# EAGLE schematic project X (EAGLE 9.6.2)
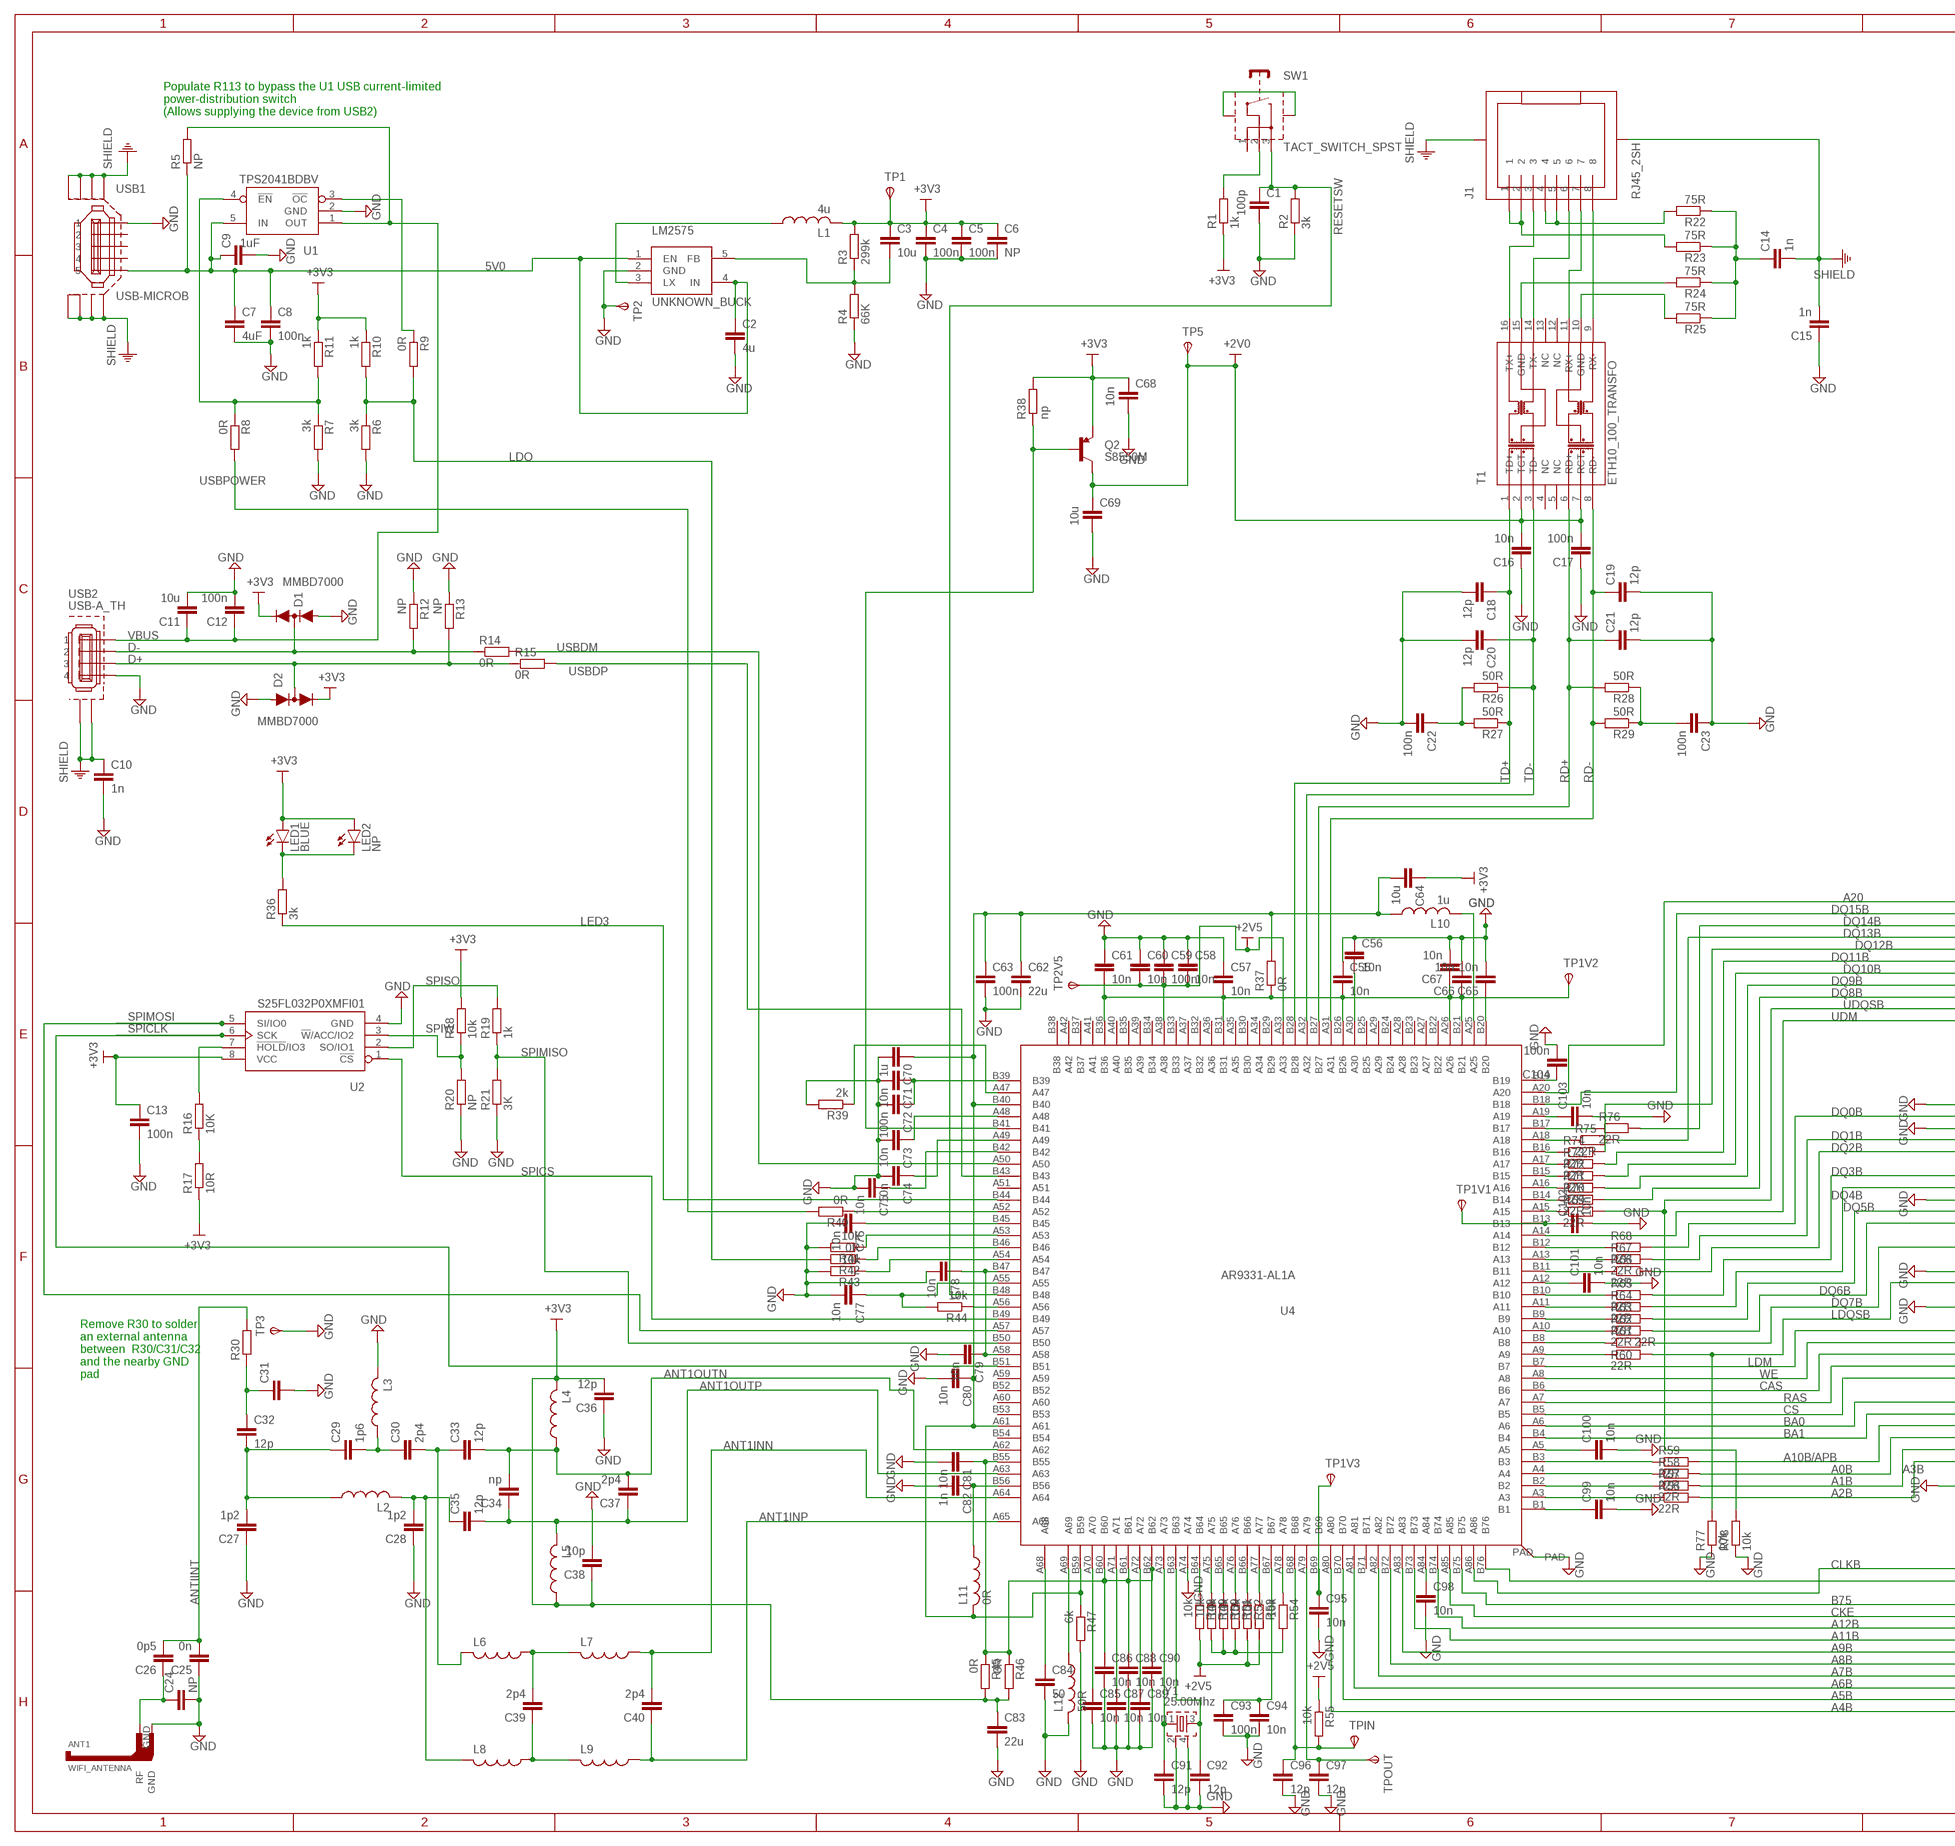
[diagram p0: schematic, sheet 1, part 1 of 2]
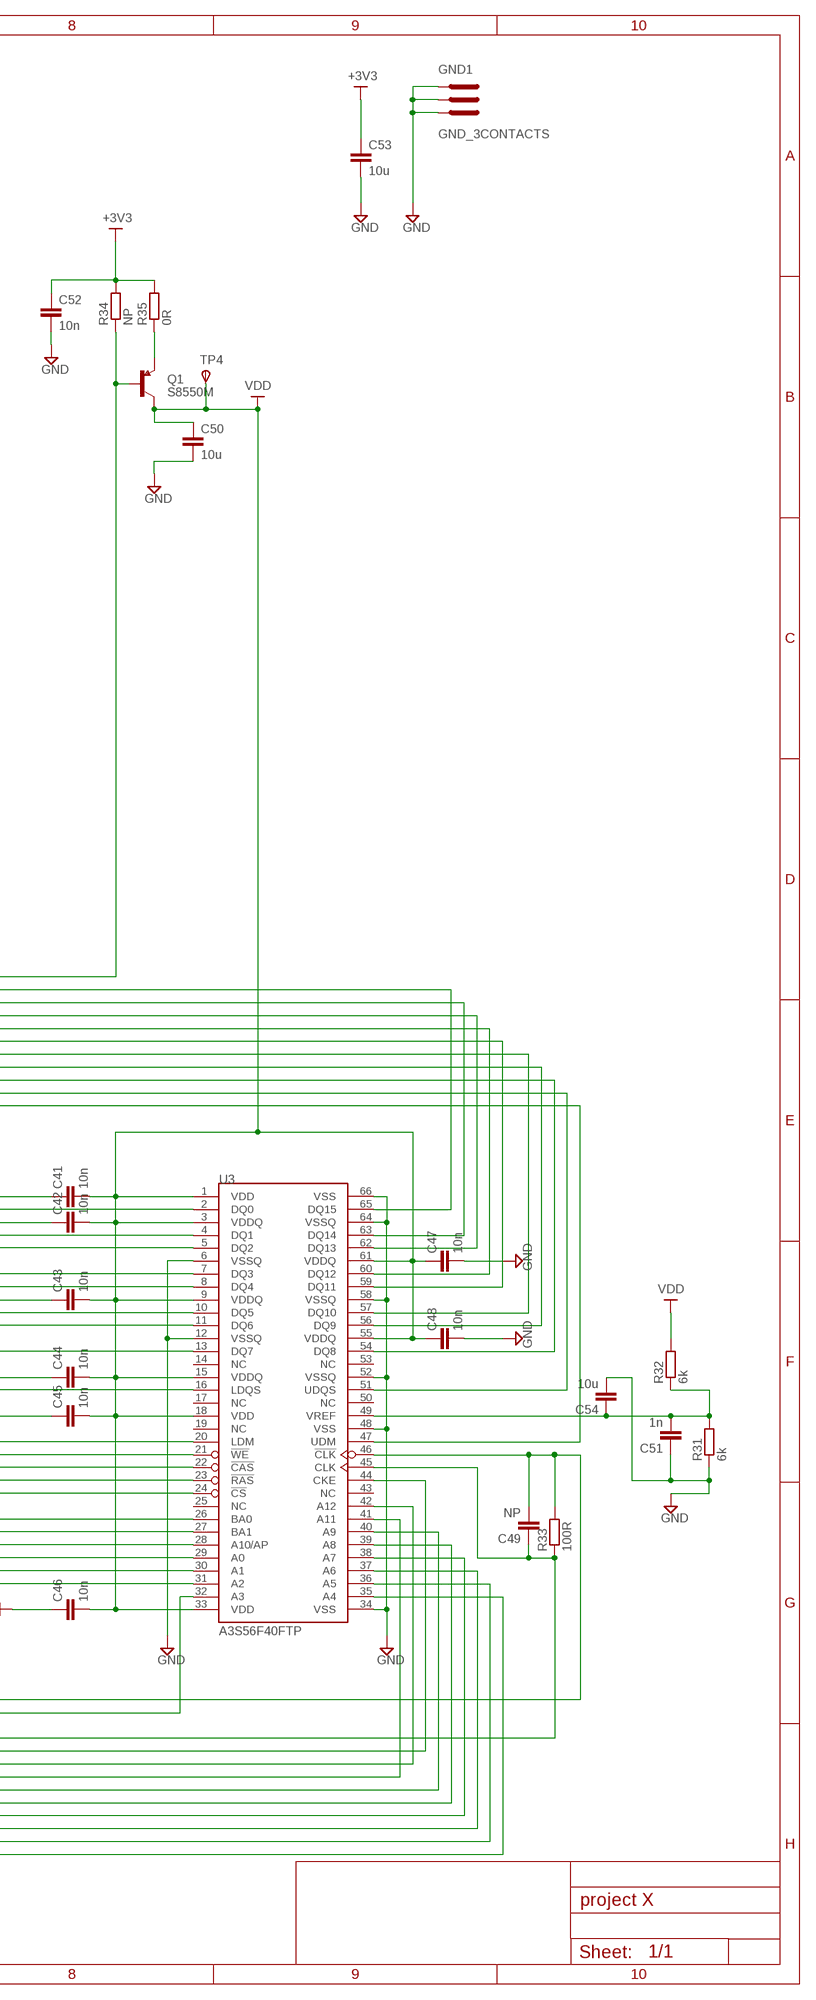
[diagram p1: schematic, sheet 1, part 2 of 2]

## Parts
ANT1  WIFI_ANTENNA  [WIFI_ANTENNA]
C1  100p  CAP_0402  [C0402]
C2  4u  CAP_0603  [C0603]
C3  10u  CAP_0603  [C0603]
C4  100n  CAP_0603  [C0603]
C5  100n  CAP_0603  [C0603]
C6  NP  CAP_0603  [C0603]
C7  4uF  CAP_0603  [C0603]
C8  100n  CAP_0603  [C0603]
C9  1uF  CAP_0603  [C0603]
C10  1n  CAP_0603  [C0603]
C11  10u  CAP_0805  [C0805]
C12  100n  CAP_0805  [C0805]
C13  100n  CAP_0603  [C0603]
C14  1n  CAP_1206  [C1206]
C15  1n  CAP_1206  [C1206]
C16  10n  CAP_1206  [C1206]
C17  100n  CAP_1206  [C1206]
C18  12p  CAP_1206  [C1206]
C19  12p  CAP_1206  [C1206]
C20  12p  CAP_1206  [C1206]
C21  12p  CAP_1206  [C1206]
C22  100n  CAP_1206  [C1206]
C23  100n  CAP_1206  [C1206]
C24  NP  CAP_0603  [C0603]
C25  0n  CAP_0603  [C0603]
C26  0p5  CAP_0603  [C0603]
C27  1p2  CAP_0603  [C0603]
C28  1p2  CAP_0603  [C0603]
C29  1p6  CAP_0603  [C0603]
C30  2p4  CAP_0603  [C0603]
C31  CAP_0603  [C0603]
C32  12p  CAP_0603  [C0603]
C33  12p  CAP_0603  [C0603]
C34  np  CAP_0603  [C0603]
C35  12p  CAP_0603  [C0603]
C36  12p  CAP_0603  [C0603]
C37  2p4  CAP_0603  [C0603]
C38  10p  CAP_0603  [C0603]
C39  2p4  CAP_0603  [C0603]
C40  2p4  CAP_0603  [C0603]
C41  10n  CAP_0603  [C0603]
C42  10n  CAP_0603  [C0603]
C43  10n  CAP_0603  [C0603]
C44  10n  CAP_0603  [C0603]
C45  10n  CAP_0603  [C0603]
C46  10n  CAP_0603  [C0603]
C47  10n  CAP_0603  [C0603]
C48  10n  CAP_0603  [C0603]
C49  NP  CAP_0603  [C0603]
C50  10u  CAP_0805  [C0805]
C51  1n  CAP_0603  [C0603]
C52  10n  CAP_0603  [C0603]
C53  10u  CAP_0805  [C0805]
C54  10u  CAP_0805  [C0805]
C55  10n  CAP_0805  [C0805]
C56  10n  CAP_0805  [C0805]
C57  10n  CAP_0805  [C0805]
C58  10n  CAP_0805  [C0805]
C59  100n  CAP_0805  [C0805]
C60  10n  CAP_0805  [C0805]
C61  10n  CAP_0805  [C0805]
C62  22u  CAP_0805  [C0805]
C63  100n  CAP_0805  [C0805]
C64  10u  CAP_0805  [C0805]
C65  10n  CAP_0805  [C0805]
C66  10n  CAP_0805  [C0805]
C67  10n  CAP_0805  [C0805]
C68  10n  CAP_0402  [C0402]
C69  10u  CAP_0402  [C0402]
C70  1u  CAP_0603  [C0603]
C71  10n  CAP_0603  [C0603]
C72  100n  CAP_0603  [C0603]
C73  10n  CAP_0603  [C0603]
C74  10n  CAP_0603  [C0603]
C75  10n  CAP_0603  [C0603]
C76  10n  CAP_0603  [C0603]
C77  10n  CAP_0603  [C0603]
C78  10n  CAP_0603  [C0603]
C79  10n  CAP_0603  [C0603]
C80  10n  CAP_0603  [C0603]
C81  10n  CAP_0603  [C0603]
C82  1n  CAP_0603  [C0603]
C83  22u  CAP_0603  [C0603]
C84  50  CAP_0603  [C0603]
C85  10n  CAP_0603  [C0603]
C86  10n  CAP_0603  [C0603]
C87  10n  CAP_0603  [C0603]
C88  10n  CAP_0603  [C0603]
C89  10n  CAP_0603  [C0603]
C90  10n  CAP_0603  [C0603]
C91  12p  CAP_0603  [C0603]
C92  12p  CAP_0603  [C0603]
C93  100n  CAP_0603  [C0603]
C94  10n  CAP_0603  [C0603]
C95  10n  CAP_0603  [C0603]
C96  12p  CAP_0603  [C0603]
C97  12p  CAP_0603  [C0603]
C98  10n  CAP_0603  [C0603]
C99  10n  CAP_0603  [C0603]
C100  10n  CAP_0603  [C0603]
C101  10n  CAP_0603  [C0603]
C102  10n  CAP_0603  [C0603]
C103  10n  CAP_0603  [C0603]
C104  100n  CAP_0603  [C0603]
D1  MMBD7000  [SOT23-3]
D2  MMBD7000  [SOT23-3]
GND1  GND_3CONTACTS  [GND_3CONTACT]
J1  RJ45_2SH  [RJ45_LP_RA_SMT]
L1  4u  IND_0402  [L0402]
L2  IND_0402  [L0402]
L3  IND_0402  [L0402]
L4  IND_0402  [L0402]
L5  IND_0402  [L0402]
L6  IND_0402  [L0402]
L7  IND_0402  [L0402]
L8  IND_0402  [L0402]
L9  IND_0402  [L0402]
L10  1u  IND_1008  [L1008]
L11  0R  IND_0402  [L0402]
L12  50R  IND_0402  [L0402]
LED1  BLUE  LED_3MM  [LED3MM]
LED2  NP  LED_3MM  [LED3MM]
LM2575  UNKNOWN_BUCK  [SOT23-5]
Q1  S8550M  TRANSISTOR_PNP  [SOT23-3]
Q2  S8550M  TRANSISTOR_PNP  [SOT23-3]
R1  1k  RES_0402  [R0402]
R2  3k  RES_0402  [R0402]
R3  299k  RES_0603  [R0603]
R4  66K  RES_0603  [R0603]
R5  NP  RES_0603  [R0603]
R6  3k  RES_0603  [R0603]
R7  3k  RES_0603  [R0603]
R8  0R  RES_0603  [R0603]
R9  0R  RES_0603  [R0603]
R10  1k  RES_0603  [R0603]
R11  1k  RES_0603  [R0603]
R12  NP  RES_0603  [R0603]
R13  NP  RES_0603  [R0603]
R14  0R  RES_0603  [R0603]
R15  0R  RES_0603  [R0603]
R16  10K  RES_0603  [R0603]
R17  10R  RES_0603  [R0603]
R18  10k  RES_0603  [R0603]
R19  1k  RES_0603  [R0603]
R20  NP  RES_0603  [R0603]
R21  3K  RES_0603  [R0603]
R22  75R  RES_0402  [R0402]
R23  75R  RES_0402  [R0402]
R24  75R  RES_0402  [R0402]
R25  75R  RES_0402  [R0402]
R26  50R  RES_0402  [R0402]
R27  50R  RES_0402  [R0402]
R28  50R  RES_0402  [R0402]
R29  50R  RES_0402  [R0402]
R30  RES_0603  [R0603]
R31  6k  RES_0603  [R0603]
R32  6k  RES_0603  [R0603]
R33  100R  RES_0603  [R0603]
R34  NP  RES_0603  [R0603]
R35  0R  RES_0603  [R0603]
R36  3k  RES_0603  [R0603]
R37  0R  RES_0603  [R0603]
R38  np  RES_0603  [R0603]
R39  2k  RES_0603  [R0603]
R40  0R  RES_0603  [R0603]
R41  10k  RES_0603  [R0603]
R42  0R  RES_0603  [R0603]
R43  10k  RES_0603  [R0603]
R44  10k  RES_0603  [R0603]
R45  0R  RES_0603  [R0603]
R46  0R  RES_0603  [R0603]
R47  6k  RES_0603  [R0603]
R48  10k  RES_0603  [R0603]
R49  10k  RES_0603  [R0603]
R50  10k  RES_0603  [R0603]
R51  10k  RES_0603  [R0603]
R52  10k  RES_0603  [R0603]
R53  10k  RES_0603  [R0603]
R54  10k  RES_0603  [R0603]
R55  10k  RES_0603  [R0603]
R56  22R  RES_0603  [R0603]
R57  22R  RES_0603  [R0603]
R58  22R  RES_0603  [R0603]
R59  22R  RES_0603  [R0603]
R60  22R  RES_0603  [R0603]
R61  22R  RES_0603  [R0603]
R62  22R  RES_0603  [R0603]
R63  22R  RES_0603  [R0603]
R64  22R  RES_0603  [R0603]
R65  22R  RES_0603  [R0603]
R66  22R  RES_0603  [R0603]
R67  22R  RES_0603  [R0603]
R68  22R  RES_0603  [R0603]
R69  22R  RES_0603  [R0603]
R70  22R  RES_0603  [R0603]
R71  22R  RES_0603  [R0603]
R72  22R  RES_0603  [R0603]
R73  22R  RES_0603  [R0603]
R74  22R  RES_0603  [R0603]
R75  22R  RES_0603  [R0603]
R76  22R  RES_0603  [R0603]
R77  10k  RES_0603  [R0603]
R78  10k  RES_0603  [R0603]
SW1  TACT_SWITCH_SPST  [TACT_SWITCH_SPST_RA_SMT]
T1  ETH10_100_TRANSFO  [H1601CG]
TP1  TEST_PAD  [TEST_PAD]
TP1V1  TEST_PAD  [TEST_PAD]
TP1V2  TEST_PAD  [TEST_PAD]
TP1V3  TEST_PAD  [TEST_PAD]
TP2  TEST_PAD  [TEST_PAD]
TP2V5  TEST_PAD  [TEST_PAD]
TP3  TEST_PAD  [TEST_PAD]
TP4  TEST_PAD  [TEST_PAD]
TP5  TEST_PAD  [TEST_PAD]
TPIN  TEST_PAD  [TEST_PAD]
TPOUT  TEST_PAD  [TEST_PAD]
U1  TPS2041BDBV  [SOT23-5]
U2  S25FL032P0XMFI01  [SOP8]
U3  A3S56F40FTP  [TSOP66]
U4  AR9331-AL1A  [DRMLF164]
USB1  USB-MICROB  [USB-MICROB]
USB2  USB-A_TH  [USB-A_TH]
Y1  25.00Mhz  CRYSTAL_2SHIELD  [CRYSTAL_32_25]

## Nets
5V0 [power]: C2.1 C7.1 C8.1 C9.1 LM2575.1(EN) LM2575.4(IN) R5.1 U1.5(IN) USB1.VBUS
+2V0 [power]: C16.2 C17.2 C69.1 Q2.3(C) T1.2(TCT) T1.7(RCT) TP5.1(PP)
+2V5 [power]: C58.2 C59.2 C60.2 R48.2 R52.2 R53.2 R55.1 TP2V5.1(PP) U4.A33 U4.A38
+3V3 [power]: C3.1 C4.1 C5.1 C6.1 C13.1 C36.2 C38.1 C52.1 C53.1 C64.1 C68.1 C83.1 D1.2(C) D2.2(C) L1.2 L4.2 L5.1 LED1.A LED2.A Q2.2(E) R1.1 R3.2 R10.1 R11.1 R17.1 R18.2 R34.2 R35.2 R38.2 R45.2 R46.2 TP1.1(PP) U2.8(VCC)
A0B: R58.2 U3.29(A0)
A1B: R57.2 U3.30(A1)
A2B: R56.2 U3.31(A2)
A3B: U3.32(A3) U4.B76
A4B: U3.35(A4) U4.A80
A5B: U3.36(A5) U4.B70
A6B: U3.37(A6) U4.A81
A7B: U3.38(A7) U4.A82
A8B: U3.39(A8) U4.B72
A9B: U3.40(A9) U4.A83
A10B/APB: R59.2 U3.28(A10/AP)
A11B: U3.41(A11) U4.B73
A12B: U3.42(A12) U4.B74
A20: Q1.1(B) R34.1 U4.A20
ANT1INN: C40.2 L7.1 U4.A64
ANT1INP [rf]: C40.1 L9.1 U4.A65
ANT1OUTN: C33.2 C34.2 C37.2 L4.1 U4.A62
ANT1OUTP: C34.1 C35.2 C37.1 L5.2 U4.A63
ANTIINT [rf]: C25.2 C26.2 R30.2
B75: C49.1 R33.1 U3.45(CLK) U4.B75
BA0: U3.26(BA0) U4.A6
BA1: U3.27(BA1) U4.B4
CAS: U3.22(!CAS) U4.B6
CKE: U3.44(CKE) U4.A85
CLKB: C49.2 R33.2 U3.46(!CLK) U4.A86
CS: U3.24(!CS) U4.B5
D+: D2.3(M) R13.2 R15.1 USB2.3
D-: D1.3(M) R12.2 R14.1 USB2.2
DQ0B: R68.2 U3.2(DQ0)
DQ1B: R67.2 U3.4(DQ1)
DQ2B: R66.2 U3.5(DQ2)
DQ3B: R65.2 U3.7(DQ3)
DQ4B: R64.2 U3.8(DQ4)
DQ5B: R63.2 U3.10(DQ5)
DQ6B: R62.2 U3.11(DQ6)
DQ7B: R61.2 U3.13(DQ7)
DQ8B: R70.2 U3.54(DQ8)
DQ9B: R71.2 U3.56(DQ9)
DQ10B: R72.2 U3.57(DQ10)
DQ11B: R73.2 U3.59(DQ11)
DQ12B: R74.2 U3.60(DQ12)
DQ13B: R75.2 U3.62(DQ13)
DQ14B: R76.2 U3.63(DQ14)
DQ15B: U3.65(DQ15) U4.B18
GND [power]: ANT1.GND C1.2 C2.2 C4.2 C5.2 C6.2 C7.2 C8.2 C9.2 C10.2 C11.2 C12.2 C13.2 C15.1 C16.1 C17.1 C18.2 C19.2 C20.2 C21.2 C22.2 C23.1 C24.2 C25.1 C27.1 C28.1 C31.2 C36.1 C38.2 C41.1 C42.1 C43.1 C44.1 C45.1 C46.1 C47.2 C48.2 C50.2 C51.1 C52.2 C53.2 C54.2 C55.1 C56.1 C57.1 C58.1 C59.1 C60.1 C61.1 C62.2 C63.2 C65.2 C66.2 C67.2 C68.2 C69.2 C70.2 C71.2 C72.2 C73.2 C74.2 C75.2 C76.2 C77.2 C78.2 C79.2 C80.2 C81.2 C82.2 C83.2 C84.2 C85.2 C86.2 C87.2 C88.2 C89.2 C90.2 C91.2 C92.2 C93.2 C94.2 C95.2 C96.2 C97.2 C98.2 C99.2 C100.2 C101.2 C102.2 C103.2 C104.2 D1.1(A) D2.1(A) GND1.GND$1(GND) GND1.GND$2(GND) GND1.GND$3(GND) L3.2 L12.2 LM2575.2(GND) R2.1 R4.1 R6.2 R7.2 R12.1 R13.1 R20.1 R21.1 R31.1 R39.2 R41.2 R43.2 R47.2 R77.1 R78.1 TP2.1(PP) TP3.1(PP) U1.2(GND) U2.4(GND) U3.6(VSSQ) U3.12(VSSQ) U3.34(VSS) U3.48(VSS) U3.52(VSSQ) U3.58(VSSQ) U3.64(VSSQ) U3.66(VSS) U4.A74 U4.PAD USB1.GND USB2.4 Y1.2 Y1.4
LDM: U3.20(LDM) U4.B7
LDO: R6.1 R9.2 R10.2 R42.2
LDQSB: R60.2 R77.2 U3.16(LDQS)
LED3: R36.1 U4.B44
N$1: C14.1 R22.1 R23.1 R24.1 R25.1
N$2: R1.2 SW1.2
N$3: SW1.S$1(SH$1) SW1.S$2(SH$2)
N$4: C3.2 LM2575.5(FB) R3.1 R4.2
N$5: C71.1 C72.1 U4.B39
N$6: Q2.1(B) R38.1 U4.B41
N$7: L1.1 LM2575.3(LX)
N$8: R7.1 R8.1 R11.2 U1.4(!EN)
N$9: C76.1 U4.B45
N$10: R40.1 U4.A52
N$11: R9.1 U1.3(!OC)
N$12: R16.1 R17.2
N$13: R16.2 U2.7(!HOLD!/IO3)
N$14: J1.1 J1.2 R23.2
N$15: J1.4 J1.5 R22.2
N$16: J1.3 T1.16(TX+)
N$17: J1.6 T1.14(TX-)
N$18: R24.2 T1.15(GND)
N$19: J1.7 T1.11(RX+)
N$20: J1.8 T1.9(RX-)
N$21: R25.2 T1.10(GND)
N$22: R41.1 U4.A53
N$23: R42.1 U4.B46
N$24: C27.2 C29.1 C32.2 L2.1
N$25: ANT1.RF C24.1 C26.1
N$26: C31.1 C32.1 R30.1
N$27: C29.2 C30.1 L3.1
N$28: C28.2 C35.1 L2.2 L8.2
N$29: C22.1 R26.2 R27.2
N$30: C30.2 C33.1 L6.2
N$31: C23.2 R28.1 R29.1
N$32: C51.2 C54.1 R31.2 R32.1 U3.49(VREF)
N$33: Q1.2(E) R35.1
N$34: C65.1 U4.B20
N$35: C39.2 L6.1 L7.2
N$36: C39.1 L8.1 L9.2
N$37: R39.1 U4.A47
N$38: LED1.K(C) LED2.K(C) R36.2
N$39: C73.1 U4.A48
N$40: C74.1 U4.A49
N$41: C75.1 U4.B42
N$42: C81.1 C86.1 C88.1 C90.1 R45.1 R46.1 U4.B55 U4.B60 U4.B61 U4.B62
N$43: C56.2 U4.A30
N$44: C55.2 C57.2 C61.2 C66.1 C67.1 R37.1 TP1V2.1(PP) U4.A26 U4.B21 U4.B26 U4.B31 U4.B36
N$45: C62.1 C63.1 C64.2 C70.1 C80.1 L10.1 L11.2 R37.2 R47.1 U4.A61 U4.B40 U4.B59
N$46: R43.1 U4.A54
N$47: C95.1 TP1V3.1(PP) U4.B69
N$48: C78.1 C79.1 U4.A58 U4.B47
N$49: C82.1 L11.1 U4.B56
N$50: C77.1 R44.2 U4.A55
N$51: R44.1 U4.A56
N$52: C91.1 U4.A73 Y1.1
N$53: C84.1 U4.A68
N$54: C92.1 U4.B63 Y1.3
N$55: L12.1 U4.A69
N$56: R49.2 R50.2 R51.2 R54.2
N$57: C85.1 U4.A70
N$58: R48.1 U4.B64
N$59: C87.1 U4.A71
N$60: R49.1 U4.A75
N$61: C89.1 U4.A72
N$62: R50.1 U4.B65
N$63: R51.1 U4.A76
N$64: R52.1 U4.B66
N$65: R53.1 U4.A77
N$66: R54.1 U4.A78
N$67: C93.1 C94.1 U4.B67
N$68: L10.2 U4.A25
N$69: C96.1 R55.2 TPIN.1(PP) U4.B68
N$70: C97.1 TPOUT.1(PP) U4.A79
N$71: C98.1 U4.A84
N$72: C99.1 U4.B1
N$73: R56.1 U4.A3
N$74: R57.1 U4.B2
N$75: C100.1 U4.A5
N$76: C101.1 U4.A12
N$77: R66.1 U4.B11
N$78: R61.1 U4.B8
N$79: R62.1 U4.A10
N$80: R63.1 U4.B9
N$81: R64.1 U4.A11
N$82: R65.1 U4.B10
N$83: R59.1 U4.B3
N$84: R58.1 U4.A4
N$85: R60.1 U4.A9
N$86: R67.1 U4.A13
N$87: R68.1 U4.B12
N$88: R69.1 U4.A15
N$89: R70.1 U4.B14
N$90: R71.1 U4.A16
N$91: C102.1 TP1V1.1(PP) U4.B13
N$92: R73.1 U4.A17
N$93: R72.1 U4.B15
N$94: R74.1 U4.B16
N$95: R75.1 U4.A18
N$96: R76.1 U4.B17
N$97: C103.1 U4.A19
N$98: C104.1 U4.B19
RAS: U3.23(!RAS) U4.A7
RD+: C21.1 R28.2 T1.6(RD+) U4.B27
RD-: C19.1 R29.2 T1.8(RD-) U4.A31
RESETSW: C1.1 R2.2 SW1.3 U4.B48
SHIELD: C10.1 C14.2 C15.2 J1.S$1(SHIELD) J1.S$2(SHIELD) USB1.P$1(M0) USB1.P$2(M7) USB1.S$1(M1) USB1.S$2(M2) USB1.S$3(M3) USB1.S$4(M4) USB1.S$5(M5) USB1.S$6(M6) USB2.S$1(M1) USB2.S$2(M2)
SPICLK: U2.6(SCK) U4.B51
SPICS: U2.1(!CS) U4.B49
SPIMISO: R19.1 R21.2 U4.B50
SPIMOSI: U2.5(SI/IO0) U4.A57
SPISO: R19.2 U2.2(SO/IO1)
SPIW: R18.1 R20.2 U2.3(!W!/ACC/IO2)
TD+: C18.1 R27.1 T1.1(TD+) U4.B28
TD-: C20.1 R26.1 T1.3(TD-) U4.A32
UDM: U3.47(UDM) U4.A14
UDQSB: R69.2 R78.2 U3.51(UDQS)
USBDM: R14.2 U4.A50
USBDP: R15.2 U4.B43
USBPOWER [power]: R8.2 R40.2
VBUS [power]: C11.1 C12.1 R5.2 U1.1(OUT) USB2.1
VDD [power]: C41.2 C42.2 C43.2 C44.2 C45.2 C46.2 C47.1 C48.1 C50.1 Q1.3(C) R32.2 TP4.1(PP) U3.1(VDD) U3.3(VDDQ) U3.9(VDDQ) U3.15(VDDQ) U3.18(VDD) U3.33(VDD) U3.55(VDDQ) U3.61(VDDQ)
WE: U3.21(!WE) U4.A8
Unconnected: SW1.1 T1.4(NC) T1.5(NC) T1.12(NC) T1.13(NC) U3.14(NC) U3.17(NC) U3.19(NC) U3.25(NC) U3.43(NC) U3.50(NC) U3.53(NC) U4.A27 U4.A28 U4.A29 U4.A34 U4.A35 U4.A36 U4.A37 U4.A39 U4.A40 U4.A41 U4.A42 U4.A51 U4.A59 U4.A60 U4.B22 U4.B23 U4.B24 U4.B25 U4.B29 U4.B30 U4.B32 U4.B33 U4.B34 U4.B35 U4.B37 U4.B38 U4.B52 U4.B53 U4.B54 U4.B71 USB1.D+ USB1.D- USB1.ID

## Notes on the sheet
- Populate R113 to bypass the U1 USB current-limited
  power-distribution switch
  (Allows supplying the device from USB2)
- Remove R30 to solder
  an external antenna
  between  R30/C31/C32
  and the nearby GND
  pad

## Library data of the parts
ANT1 = TL-WR703N:WIFI_ANTENNA: Wifi PCB Antenna Copyright © 2012, Michel Stempin, All rights reserved Licenced under Creative Commons CC BY-SA 3.0 <http://creativecommons.org/licenses/by-sa/3.0/deed.en> license.
C1-C104 = TL-WR703N:CAP_: Capacitor Copyright © 2012, Michel Stempin, All rights reserved Licenced under Creative Commons CC BY-SA 3.0 <http://creativecommons.org/licenses/by-sa/3.0/deed.en> license.
D1 D2 = TL-WR703N:MMBD7000: Dual Small Signal Switching Diode in Series Based on: MMBD7000 Datasheet <http://www.taitroncomponents.com/catalog/Datasheet/MMBD7000.pdf> Copyright © 2012, Michel Stempin, All rights reserved Licenced under Creative Commons CC BY-SA 3.0 <http://creativecommons.org/licenses/by-sa/3.0/deed.en> license.
GND1 = TL-WR703N:GND_3CONTACTS: Ground Contacts x3 Copyright © 2012, Michel Stempin, All rights reserved Licenced under Creative Commons CC BY-SA 3.0 <http://creativecommons.org/licenses/by-sa/3.0/deed.en> license.
J1 = TL-WR703N:RJ45_2SH: RJ45 Socket with 2 Shield Pins Copyright © 2012, Michel Stempin, All rights reserved Licenced under Creative Commons CC BY-SA 3.0 <http://creativecommons.org/licenses/by-sa/3.0/deed.en> license.
L1-L12 = TL-WR703N:IND_: Inductor Copyright © 2012, Michel Stempin, All rights reserved Licenced under Creative Commons CC BY-SA 3.0 <http://creativecommons.org/licenses/by-sa/3.0/deed.en> license.
LED1 LED2 = TL-WR703N:LED_: LED Copyright © 2012, Michel Stempin, All rights reserved Licenced under Creative Commons CC BY-SA 3.0 <http://creativecommons.org/licenses/by-sa/3.0/deed.en> license.
LM2575 = TL-WR703N:UNKNOWN_BUCK: Unknown Buck Switching DC/DC Converter with Built-In Schottky Diode Copyright © 2012, Michel Stempin, All rights reserved Licenced under Creative Commons CC BY-SA 3.0 <http://creativecommons.org/licenses/by-sa/3.0/deed.en> license.
Q1 Q2 = TL-WR703N:TRANSISTOR_PNP: PNP Transistor Copyright © 2012, Michel Stempin, All rights reserved Licenced under Creative Commons CC BY-SA 3.0 <http://creativecommons.org/licenses/by-sa/3.0/deed.en> license.
R1-R78 = TL-WR703N:RES_: Resistor Copyright © 2012, Michel Stempin, All rights reserved Licenced under Creative Commons CC BY-SA 3.0 <http://creativecommons.org/licenses/by-sa/3.0/deed.en> license.
SW1 = TL-WR703N:TACT_SWITCH_SPST: Tact Switch SPST with 2 Contacts and 2 Shield Pins Copyright © 2012, Michel Stempin, All rights reserved Licenced under Creative Commons CC BY-SA 3.0 <http://creativecommons.org/licenses/by-sa/3.0/deed.en> license.
T1 = TL-WR703N:ETH10_100_TRANSFO: 10/100Base Single Port Transformer Based on: H1601CG Datasheet <http://www.cptc.com.tw/product/doc/Single%20Port/H1601CG.pdf> Copyright © 2012, Michel Stempin, All rights reserved Licenced under Creative Commons CC BY-SA 3.0 <http://creativecommons.org/licenses/by-sa/3.0/deed.en> license.
TP1 TP1V1-TP1V3 TP2 TP2V5 TP3-TP5 TPIN TPOUT = TL-WR703N:TEST_PAD: Test Pad Copyright © 2012, Michel Stempin, All rights reserved Licenced under Creative Commons CC BY-SA 3.0 <http://creativecommons.org/licenses/by-sa/3.0/deed.en> license.
U1 = TL-WR703N:TPS2041B: Single USB Power Distribution Switch in 5-Pin Package Based on: TPS2051B Datasheet <http://www.ti.com/lit/ds/symlink/tps2051b.pdf> Copyright © 2012, Michel Stempin, All rights reserved Licenced under Creative Commons CC BY-SA 3.0 <http://creativecommons.org/licenses/by-sa/3.0/deed.en> license.
U2 = TL-WR703N:S25FL: 32-Mbit CMOS 3.0 Volt Flash Memory with 104-MHz SPI (Serial Peripheral Interface) Multi I/O Bus Based on: S25FL032P Datasheet <http://www.spansion.com/Support/Datasheets/S25FL032P_00.pdf> Copyright © 2012, Michel Stempin, All rights reserved Licenced under Creative Commons CC BY-SA 3.0 <http://creativecommons.org/licenses/by-sa/3.0/deed.en> license.; DENSITY: 32 Mbit
U3 = TL-WR703N:A3S56: 256Mb DDR SDRAM Copyright © 2012, Michel Stempin, All rights reserved Licenced under Creative Commons CC BY-SA 3.0 <http://creativecommons.org/licenses/by-sa/3.0/deed.en> license.; WIDTH: 16-bit
U4 = TL-WR703N:AR9331-: Atheros AR9331 SoC Copyright © 2012, Michel Stempin, All rights reserved Licenced under Creative Commons CC BY-SA 3.0 <http://creativecommons.org/licenses/by-sa/3.0/deed.en> license.
USB1 = TL-WR703N:USB-MICROB: Micro-USB B Socket, 6 Shield Pins Copyright © 2012, Michel Stempin, All rights reserved Licenced under Creative Commons CC BY-SA 3.0 <http://creativecommons.org/licenses/by-sa/3.0/deed.en> license.
USB2 = TL-WR703N:USB-A_TH: USB A Through-Hole Socket Copyright © 2012, Michel Stempin, All rights reserved Licenced under Creative Commons CC BY-SA 3.0 <http://creativecommons.org/licenses/by-sa/3.0/deed.en> license.
Y1 = TL-WR703N:CRYSTAL_2SHIELD: Crystal with 2 Shield Pins Copyright © 2012, Michel Stempin, All rights reserved Licenced under Creative Commons CC BY-SA 3.0 <http://creativecommons.org/licenses/by-sa/3.0/deed.en> license.

## Net classes
0 default: width 0.051 mm, clearance 0.051 mm
1 power: width 0.254 mm, clearance 0.254 mm
2 rf: width 0.254 mm, clearance 0.254 mm